# EAGLE design Own_RPi.Streamerboard.pro_v1.2_Final_AR (EAGLE 9.6.2)
COMPANY: ADAFRUIT INDUSTRIES; DRAWN: KTOWN; REV: A; YEAR: 2019
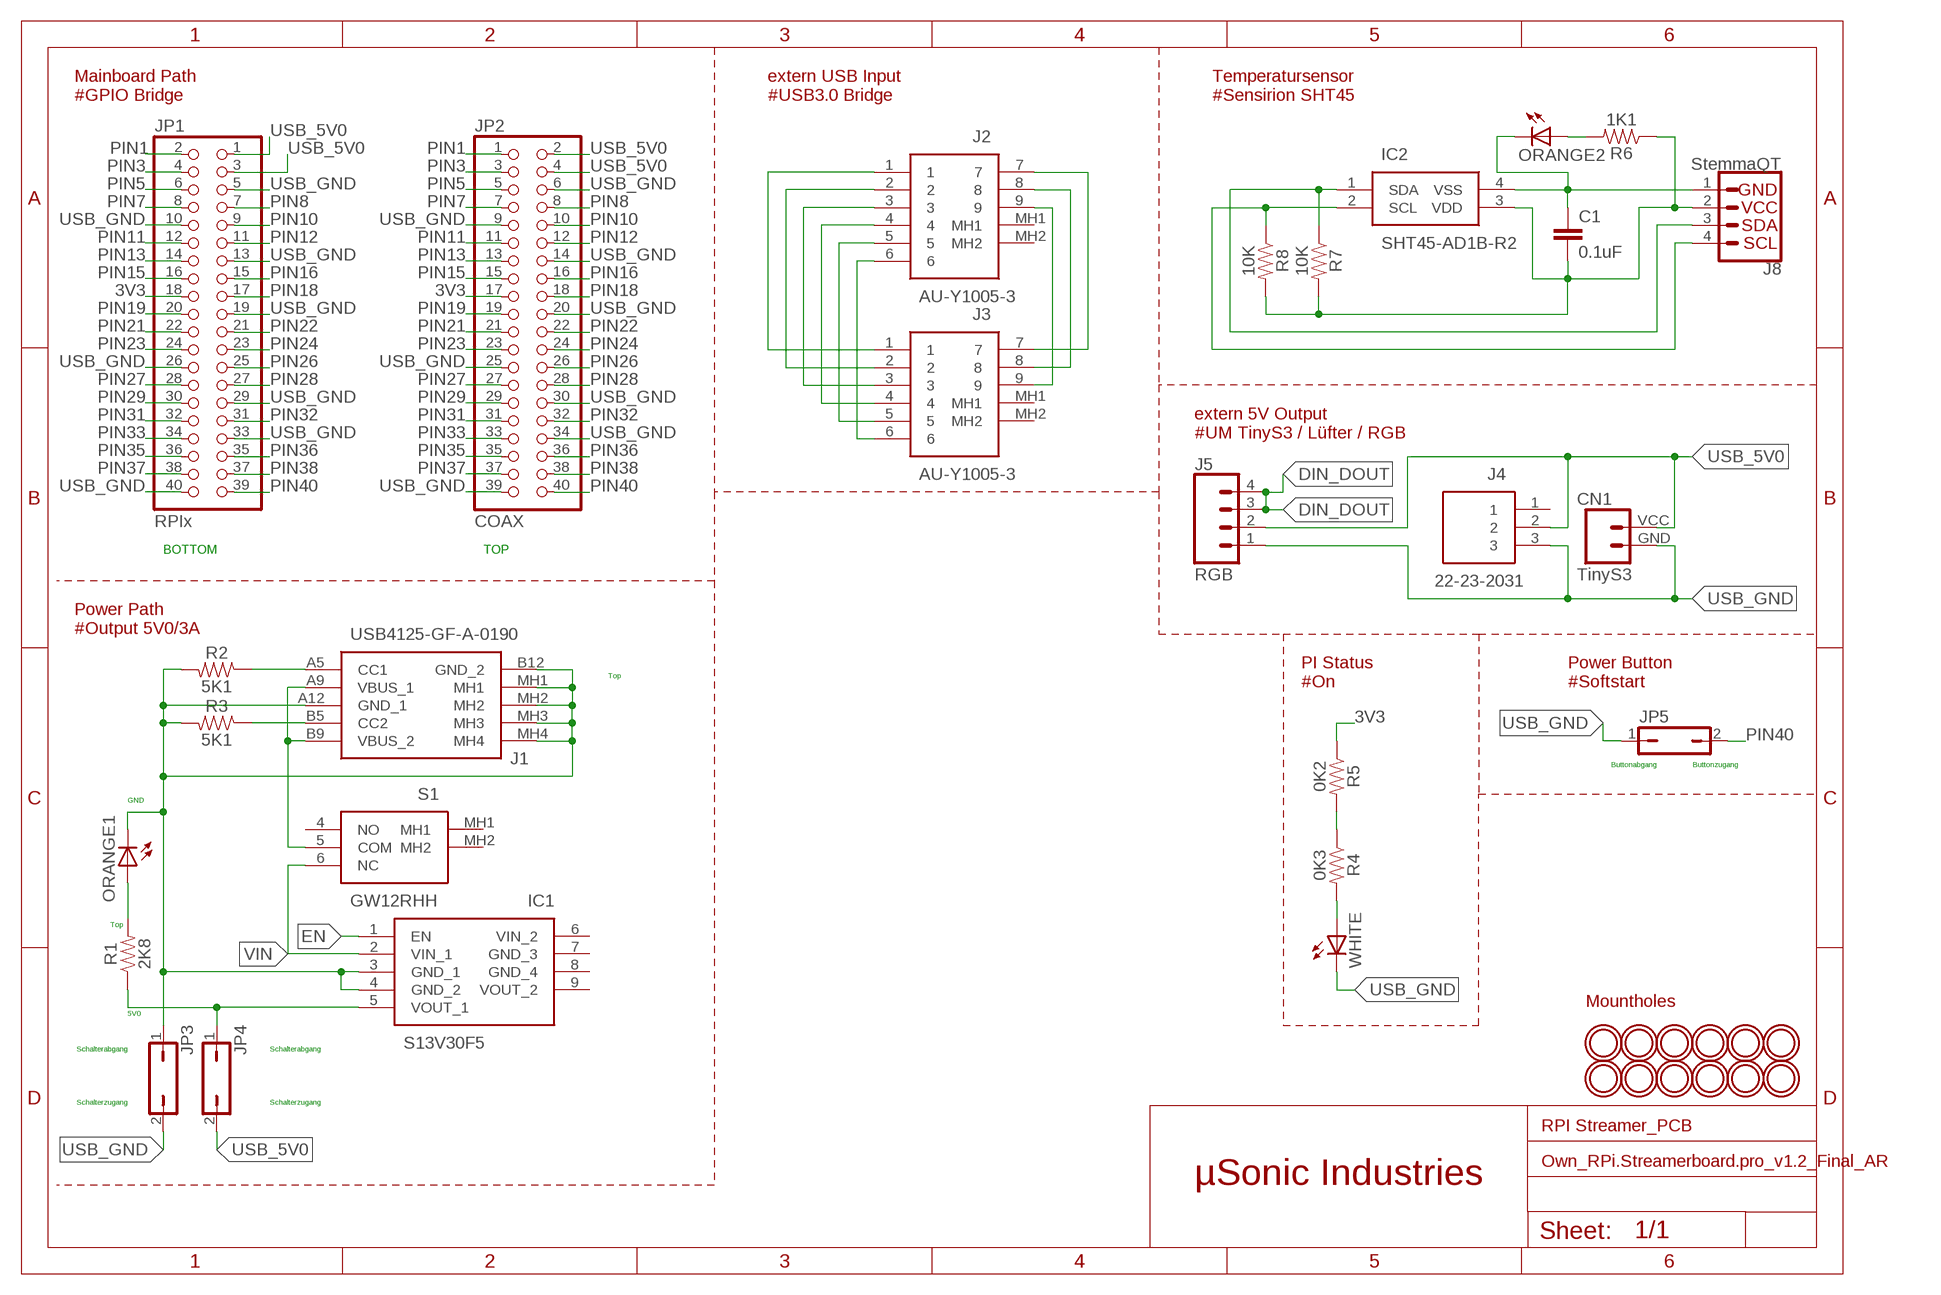
[diagram p0: schematic, sheet 1]

## Parts
C1  0.1uF  1.0UF-0805-25V-10%  [0805]
CN1  TinyS3  CONN_024UCON-15767  [JST-2-SMD-VERT]
IC1  S13V30F5  [S13V30F5]
IC2  SHT45-AD1B-R2  [SHT45AD1BR2]
J1  USB4125-GF-A-0190  [USB4125GFA0190]
J2  AU-Y1005-3  [AUY10053]
J3  AU-Y1005-3  [AUY10053]
J4  22-23-2031  [SHDR3W82P0X254_1X3_747X635X818]
J5  RGB  CONN_04PTH  [1X04]
J8  StemmaQT  QWIIC_CONNECTOROWN  [JST04_1MM_VERT]
JP1  RPIx  PINHD-2X20-BIG  [2X20-BIG]
JP2  COAX  PINHD-2X20-BIG  [2X20-BIG]
JP3  JP1Q  [JP1]
JP4  JP1Q  [JP1]
JP5  JP1Q  [JP1]
ORANGE1  LEDCHIPLED_0805  [CHIPLED_0805]
ORANGE2  LEDCHIPLED_0805  [CHIPLED_0805]
R1  2K8  RESISTOR0805  [0805]
R2  5K1  RESISTOR0805  [0805]
R3  5K1  RESISTOR0805  [0805]
R4  0K3  RESISTOR0805  [0805]
R5  0K2  RESISTOR0805  [0805]
R6  1K1  RESISTOR0805  [0805]
R7  10K  RESISTOR0805  [0805]
R8  10K  RESISTOR0805  [0805]
S1  GW12RHH  [GW12RHH]
U$3  MOUNTINGHOLE2.5  [MOUNTINGHOLE_2.5_PLATED]
U$5  MOUNTINGHOLE2.5  [MOUNTINGHOLE_2.5_PLATED]
U$8  MOUNTINGHOLE2.5  [MOUNTINGHOLE_2.5_PLATED]
U$9  MOUNTINGHOLE2.5  [MOUNTINGHOLE_2.5_PLATED]
U$10  MOUNTINGHOLE2.5  [MOUNTINGHOLE_2.5_PLATED]
U$11  MOUNTINGHOLE2.5  [MOUNTINGHOLE_2.5_PLATED]
U$12  MOUNTINGHOLE2.5  [MOUNTINGHOLE_2.5_PLATED]
U$13  MOUNTINGHOLE2.5  [MOUNTINGHOLE_2.5_PLATED]
U$14  MOUNTINGHOLE2.5  [MOUNTINGHOLE_2.5_PLATED]
U$15  MOUNTINGHOLE2.5  [MOUNTINGHOLE_2.5_PLATED]
U$16  MOUNTINGHOLE2.5  [MOUNTINGHOLE_2.5_PLATED]
U$17  MOUNTINGHOLE2.5  [MOUNTINGHOLE_2.5_PLATED]
WHITE  LEDCHIPLED_0805  [CHIPLED_0805]

## Nets
3V3: JP1.18 JP2.17 R5.1
DIN_DOUT: J5.3 J5.4
EN: IC1.1(EN)
GND: IC1.3(GND_1) IC1.4(GND_2) J1.A12(GND_1) J1.B12(GND_2) J1.MH1 J1.MH2 J1.MH3 J1.MH4 JP3.1 ORANGE1.C R2.2 R3.2
N$1: ORANGE1.A R1.2
N$2: R4.1 R5.2
N$3: J1.B5(CC2) R3.1
N$4: J1.A5(CC1) R2.1
N$5: J2.4 J3.4
N$6: ORANGE2.A R6.2
N$7: R4.2 WHITE.A
N$10: C1.2 IC2.3(VDD) J8.2 R6.1 R7.2 R8.2
N$13: C1.1 IC2.4(VSS) J8.1 ORANGE2.C
N$14: IC2.2(SCL) J8.4 R8.1
N$15: J2.6 J3.6
N$16: IC2.1(SDA) J8.3 R7.1
N$17: J2.5 J3.5
N$19: J2.3 J3.3
N$20: J2.2 J3.2
N$21: J2.1 J3.1
N$22: J2.9 J3.9
N$23: J2.8 J3.8
N$24: J2.7 J3.7
PIN1: JP1.2 JP2.1
PIN3: JP1.4 JP2.3
PIN5: JP1.6 JP2.5
PIN7: JP1.8 JP2.7
PIN8: JP1.7 JP2.8
PIN10: JP1.9 JP2.10
PIN11: JP1.12 JP2.11
PIN12: JP1.11 JP2.12
PIN13: JP1.14 JP2.13
PIN15: JP1.16 JP2.15
PIN16: JP1.15 JP2.16
PIN18: JP1.17 JP2.18
PIN19: JP1.20 JP2.19
PIN21: JP1.22 JP2.21
PIN22: JP1.21 JP2.22
PIN23: JP1.24 JP2.23
PIN24: JP1.23 JP2.24
PIN26: JP1.25 JP2.26
PIN27: JP1.28 JP2.27
PIN28: JP1.27 JP2.28
PIN29: JP1.30 JP2.29
PIN31: JP1.32 JP2.31
PIN32: JP1.31 JP2.32
PIN33: JP1.34 JP2.33
PIN35: JP1.36 JP2.35
PIN36: JP1.35 JP2.36
PIN37: JP1.38 JP2.37
PIN38: JP1.37 JP2.38
PIN40: JP1.39 JP2.40 JP5.2
USB_5V0: CN1.VCC J4.2 J5.2 JP1.1 JP1.3 JP2.2 JP2.4 JP4.2
USB_GND: CN1.GND J4.3 J5.1 JP1.5 JP1.10 JP1.13 JP1.19 JP1.26 JP1.29 JP1.33 JP1.40 JP2.6 JP2.9 JP2.14 JP2.20 JP2.25 JP2.30 JP2.34 JP2.39 JP3.2 JP5.1 WHITE.C
VBUS_VIN: J1.A9(VBUS_1) J1.B9(VBUS_2) S1.5(COM)
VIN: IC1.2(VIN_1) S1.6(NC)
VOUT: IC1.5(VOUT_1) JP4.1 R1.1
Unconnected: IC1.6(VIN_2) IC1.7(GND_3) IC1.8(GND_4) IC1.9(VOUT_2) J2.MH1 J2.MH2 J3.MH1 J3.MH2 J4.1 S1.4(NO) S1.MH1 S1.MH2

## Notes on the sheet
- Mainboard Path
  #GPIO Bridge
- extern USB Input
  #USB3.0 Bridge
- Temperatursensor
  #Sensirion SHT45
- extern 5V Output
  #UM TinyS3 / Lüfter / RGB
- BOTTOM | TOP
- RGB
- Power Path
  #Output 5V0/3A
- Top
- PI Status
  #On
- Power Button
  #Softstart
- Buttonabgang | Buttonzugang
- GND
- Top
- Mountholes
- 5V0
- Schalterabgang | Schalterabgang
- Schalterzugang | Schalterzugang
- RPI Streamer_PCB
- µSonic Industries

## Library data of the parts
C1 = SparkFun-Capacitors:1.0UF: 1µF ceramic capacitors A capacitor is a passive two-terminal electrical component used to store electrical energy temporarily in an electric field.; PROD_ID: CAP-08064; VALUE: 1.0uF
CN1 = SparkFun-Connectors2:CONN_02: Multi connection point. Often used as Generic Header-pin footprint for 0.1 inch spaced/style header connections On any of the 0.1 inch spaced packages, you can populate with these: Break Away Headers - Straight <https://www.sparkfun.com/products/116> (PRT-00116) Break Away Male Headers - Right Angle <https://www.sparkfun.com/products/553> (PRT-00553) Female Headers <https://www.sparkfun.com/products/115> (PRT-00115) Break Away Headers - Machine Pin <https://www.sparkfun.com/products/117> (PRT-00117) Break Away Female Headers - Swiss Machine Pin <https://www.sparkfun.com/products/743> (PRT-00743) For SCREWTERMINALS and SPRING TERMINALS visit here: Screw Terimnals on SparkFun.com <https://www.sparkfun.com/search/results?term=Screw+Terminals> (5mm/3.5mm/2.54mm spacing) This device is also useful as a general connection point to wire up your design to another part of your project. Our various solder wires solder well into these plated through hole pads. Hook-Up Wire - Assortment (Stranded, 22 AWG) <https://www.sparkfun.com/products/11375> (PRT-11375) Hook-Up Wire - Assortment (Solid Core, 22 AWG) <https://www.sparkfun.com/products/11367> (PRT-11367) View the entire wire category on our website here <https://www.sparkfun.com/categories/141> Special notes: Molex polarized connector foot print use with: PRT-08233 with associated crimp pins and housings. 2.54_SCREWTERM for use with PRT-10571. 3.5mm Screw Terminal footprints for PRT-08084 5mm Screw Terminal footprints for use with PRT-08432
IC1 = S13V30F5:S13V30F5: 5V Step-Up/Step-Down Voltage Regulator Source: Datasheet <https://www.pololu.com/file/0J1807/5v-step-up-step-down-voltage-regulator-s13v30f5-dimensions.pdf>; DESCRIPTION: 5V Step-Up/Step-Down Voltage Regulator; HEIGHT: 9.57mm; MANUFACTURER_NAME: Pololu; MANUFACTURER_PART_NUMBER: S13V30F5
IC2 = SHT45-AD1B-R2:SHT45-AD1B-R2: 4 4th Generation, High-Accuracy, Ultra-Low-Power, 16-bit Relative Humidity and Temperature Sensor Source: Datasheet <https://www.mouser.de/datasheet/2/682/Datasheet_SHT4x-2936319.pdf>; ARROW_PART_NUMBER: SHT45-AD1B-R2; ARROW_PRICE-STOCK: https://www.arrow.com/en/products/sht45-ad1b-r2/sensirion-ag?region=nac; DESCRIPTION: 4 4th Generation, High-Accuracy, Ultra-Low-Power, 16-bit Relative Humidity and Temperature Sensor; HEIGHT: 0.59mm; MANUFACTURER_NAME: Sensirion; MANUFACTURER_PART_NUMBER: SHT45-AD1B-R2; MOUSER_PART_NUMBER: 403-SHT45-AD1B-R2; MOUSER_PRICE-STOCK: https://www.mouser.co.uk/ProductDetail/Sensirion/SHT45-AD1B-R2?qs=Znm5pLBrcAImXcmTJwn%2FTg%3D%3D
J1 = USB4125-GF-A-0190:USB4125-GF-A-0190: USB Connectors USB C Rec GF RA 6P SMT TH Stakes 1.9mm Source: Datasheet <https://eu.mouser.com/datasheet/2/837/usb4125-2448699.pdf>; DESCRIPTION: USB Connectors USB C Rec GF RA 6P SMT TH Stakes 1.9mm; HEIGHT: 3.41mm; MANUFACTURER_NAME: GCT (GLOBAL CONNECTOR TECHNOLOGY); MANUFACTURER_PART_NUMBER: USB4125-GF-A-0190; MOUSER_PART_NUMBER: 640-USB4125-GF-A-190; MOUSER_PRICE-STOCK: https://www.mouser.co.uk/ProductDetail/GCT/USB4125-GF-A-0190?qs=QNEnbhJQKvbCz4hEJBS24w%3D%3D
J2 J3 = AU-Y1005-3:AU-Y1005-3: CONN USB 3.0 R/A FMAL TYPE-A PCB Source: Datasheet <https://datasheet.datasheetarchive.com/originals/distributors/DKDS-12/221023.pdf>; ARROW_PART_NUMBER: AU-Y1005-3; ARROW_PRICE-STOCK: https://www.arrow.com/en/products/au-y1005-3/assmann-wsw-components-inc?region=nac; DESCRIPTION: CONN USB 3.0 R/A FMAL TYPE-A PCB; HEIGHT: 7.2mm; MANUFACTURER_NAME: ASSMANN WSW components GmbH; MANUFACTURER_PART_NUMBER: AU-Y1005-3
J4 = 22-23-2031:22-23-2031: 2.54mm,header,KK,vert,Sn,frictn lock,3w Molex KK 254 Series, Series Number 6373, 2.54mm Pitch 3 Way 1 Row Straight PCB Header, Through Hole, Solder Termination Source: Datasheet <http://www.molex.com/webdocs/datasheets/pdf/en-us//0022232031_PCB_HEADERS.pdf>; DESCRIPTION: 2.54mm,header,KK,vert,Sn,frictn lock,3w Molex KK 254 Series, Series Number 6373, 2.54mm Pitch 3 Way 1 Row Straight PCB Header, Through Hole, Solder Termination; HEIGHT: 8.18mm; MANUFACTURER_NAME: Molex; MANUFACTURER_PART_NUMBER: 22-23-2031; MOUSER_PART_NUMBER: 538-22-23-2031; MOUSER_PRICE-STOCK: https://www.mouser.co.uk/ProductDetail/Molex/22-23-2031?qs=ILqg114nvd41XyIAFDpXfw%3D%3D
J5 = SparkFun-Connectors2:CONN_04: Multi connection point. Often used as Generic Header-pin footprint for 0.1 inch spaced/style header connections On any of the 0.1 inch spaced packages, you can populate with these: Break Away Headers - Straight <https://www.sparkfun.com/products/116> (PRT-00116) Break Away Male Headers - Right Angle <https://www.sparkfun.com/products/553> (PRT-00553) Female Headers <https://www.sparkfun.com/products/115> (PRT-00115) Break Away Headers - Machine Pin <https://www.sparkfun.com/products/117> (PRT-00117) Break Away Female Headers - Swiss Machine Pin <https://www.sparkfun.com/products/743> (PRT-00743) For SCREWTERMINALS and SPRING TERMINALS visit here: Screw Terimnals on SparkFun.com <https://www.sparkfun.com/search/results?term=Screw+Terminals> (5mm/3.5mm/2.54mm spacing) This device is also useful as a general connection point to wire up your design to another part of your project. Our various solder wires solder well into these plated through hole pads. Hook-Up Wire - Assortment (Stranded, 22 AWG) <https://www.sparkfun.com/products/11375> (PRT-11375) Hook-Up Wire - Assortment (Solid Core, 22 AWG) <https://www.sparkfun.com/products/11367> (PRT-11367) View the entire wire category on our website here <https://www.sparkfun.com/categories/141> Special notes: Molex polarized connector foot print use with SKU : PRT-08231 with associated crimp pins and housings. 1MM SMD Version SKU: PRT-10208; PROD_ID: CONN-09696
J8 = SparkFun-Connectors2:QWIIC_CONNECTOR: SparkFun I2C Standard Qwiic Connector An SMD 1mm pitch JST connector makes it easy and quick (get it? Qwiic?) to connect I2C devices to each other. The Qwiic system <http://www.sparkfun.com/qwiic> enables fast and solderless connection between popular platforms and various sensors and actuators. We carry 200mm <https://www.sparkfun.com/products/14204>, 100mm <https://www.sparkfun.com/products/14205>, 50mm <https://www.sparkfun.com/products/14206>, and breadboard friendly <https://www.sparkfun.com/products/14207> Qwiic cables. We also offer 10 pcs strips <https://www.sparkfun.com/products/14323> the SMD connectors.; PROD_ID: CONN-14483; VALUE: Vertical Qwiic Connector
JP1 JP2 = adafruit:PINHD-2X20: PIN HEADER
JP3-JP5 = jumper:JP1Q: JUMPER
ORANGE1 ORANGE2 WHITE = adafruit:LED: LED OSRAM: - CHIPLED LG R971, LG N971, LY N971, LG Q971, LY Q971, LO R971, LY R971 LH N974, LH R974 LS Q976, LO Q976, LY Q976 LO Q996 - Hyper CHIPLED LW Q18S LB Q993, LB Q99A, LB R99A - SideLED LS A670, LO A670, LY A670, LG A670, LP A670 LB A673, LV A673, LT A673, LW A673 LH A674 LY A675 LS A676, LA A676, LO A676, LY A676, LW A676 LS A679, LY A679, LG A679 - Hyper Micro SIDELED® LS Y876, LA Y876, LO Y876, LY Y876 LT Y87S - SmartLED LW L88C, LW L88S LB L89C, LB L89S, LG L890 LS L89K, LO L89K, LY L89K LS L896, LA L896, LO L896, LY L896 - TOPLED LS T670, LO T670, LY T670, LG T670, LP T670 LSG T670, LSP T670, LSY T670, LOP T670, LYG T670 LG T671, LOG T671, LSG T671 LB T673, LV T673, LT T673, LW T673 LH T674 LS T676, LA T676, LO T676, LY T676, LB T676, LH T676, LSB T676, LW T676 LB T67C, LV T67C, LT T67C, LS T67K, LO T67K, LY T67K, LW E67C LS E67B, LA E67B, LO E67B, LY E67B, LB E67C, LV E67C, LT E67C LW T67C LS T679, LY T679, LG T679 LS T770, LO T770, LY T770, LG T770, LP T770 LB T773, LV T773, LT T773, LW T773 LH T774 LS E675, LA E675, LY E675, LS T675 LS T776, LA T776, LO T776, LY T776, LB T776 LHGB T686 LT T68C, LB T68C - Hyper Mini TOPLED® LB M676 - Mini TOPLED Santana® LG M470 LS M47K, LO M47K, LY M47K Source: http://www.osram.convergy.de/
R1-R8 = SparkFun-Resistors:RESISTOR: Generic Resistor Package
S1 = GW12RHH:GW12RHH: NKK SWITCHES - GW12RHH - Rocker Switch, On-None-On, SPDT, Non Illuminated, Through Hole, Grey, GW Series Source: Datasheet <https://www.nkkswitches.com/pdf/GW.pdf>; ARROW_PART_NUMBER: GW12RHH; ARROW_PRICE-STOCK: https://www.arrow.com/en/products/gw12rhh/nkk-switches?region=nac; DESCRIPTION: NKK SWITCHES - GW12RHH - Rocker Switch, On-None-On, SPDT, Non Illuminated, Through Hole, Grey, GW Series; HEIGHT: 5.4mm; MANUFACTURER_NAME: NKK Switches; MANUFACTURER_PART_NUMBER: GW12RHH; MOUSER_PART_NUMBER: 633-GW12RHH; MOUSER_PRICE-STOCK: https://www.mouser.co.uk/ProductDetail/NKK-Switches/GW12RHH?qs=4EnmSMTL3HPCG3meE6aDvQ%3D%3D
U$3 U$5 U$8-U$17 = microbuilder:MOUNTINGHOLE: Mounting Hole For #2 screws (0.086"/2.18mm width, 0.094"/2.4mm hole) use 2.5mm; BOM: EXCLUDE

## Net classes
0 default: width 0.25 mm

## Board
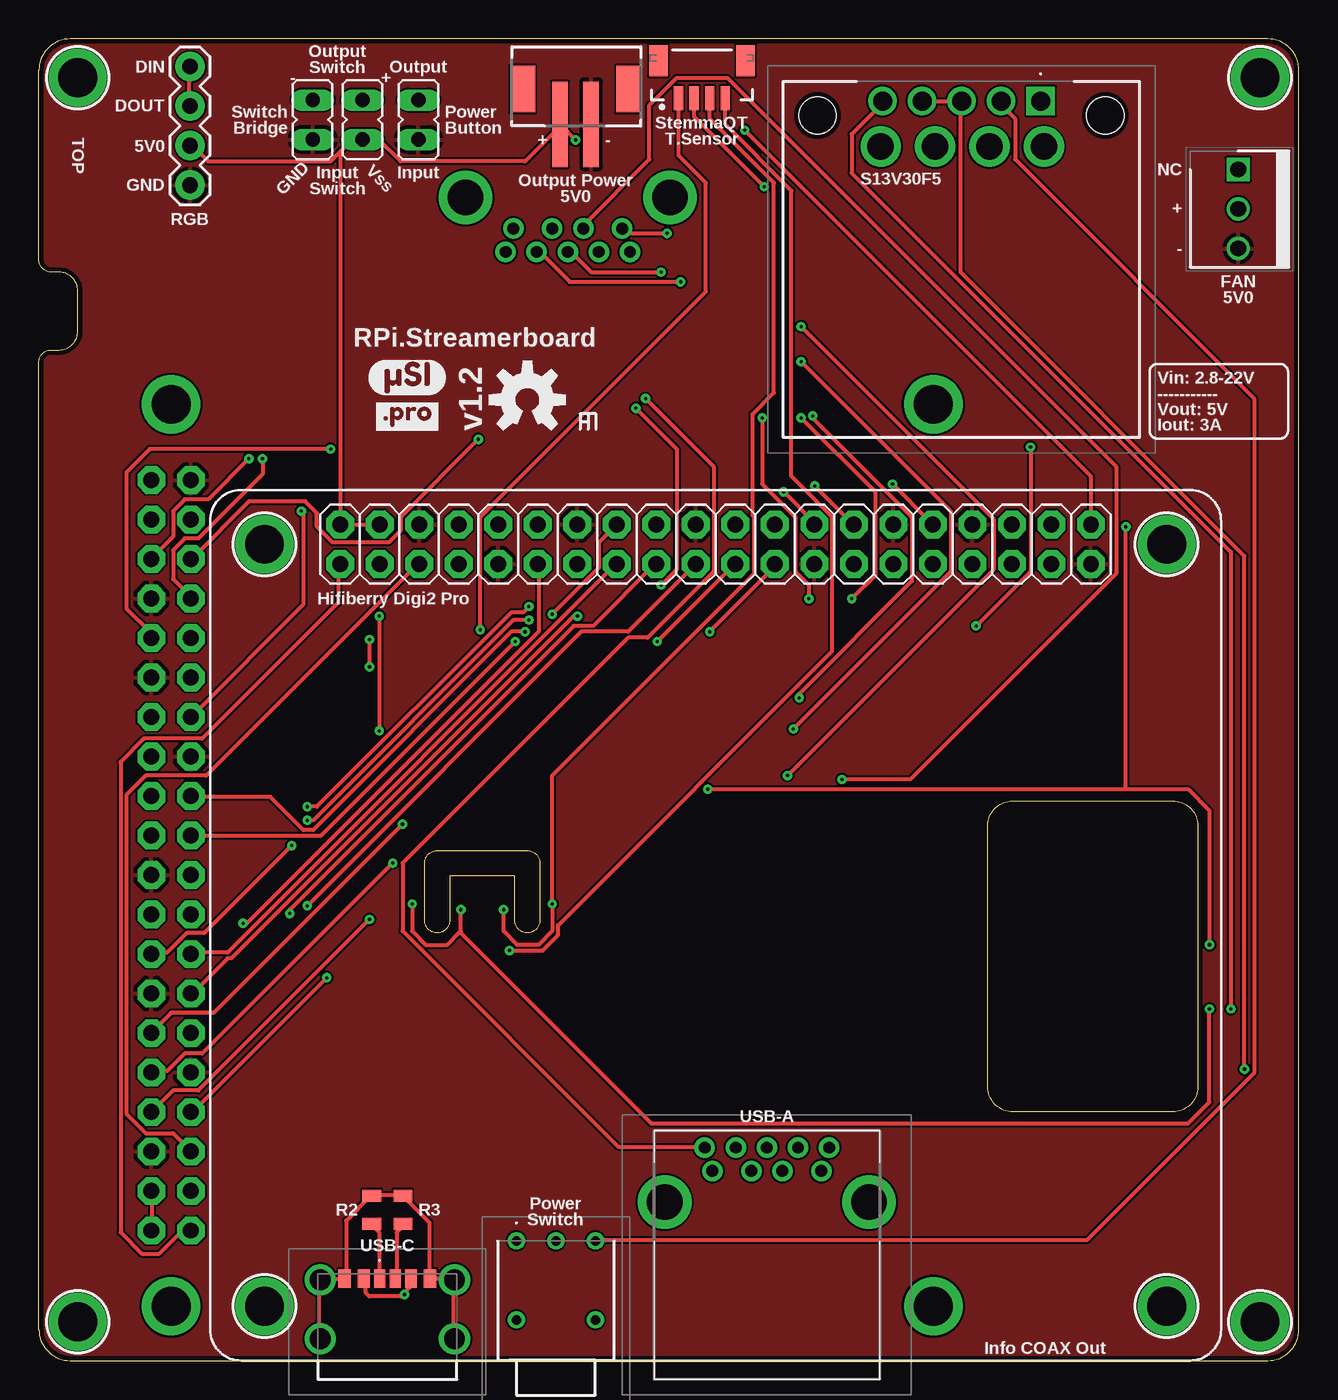
[diagram p1: board, top side]
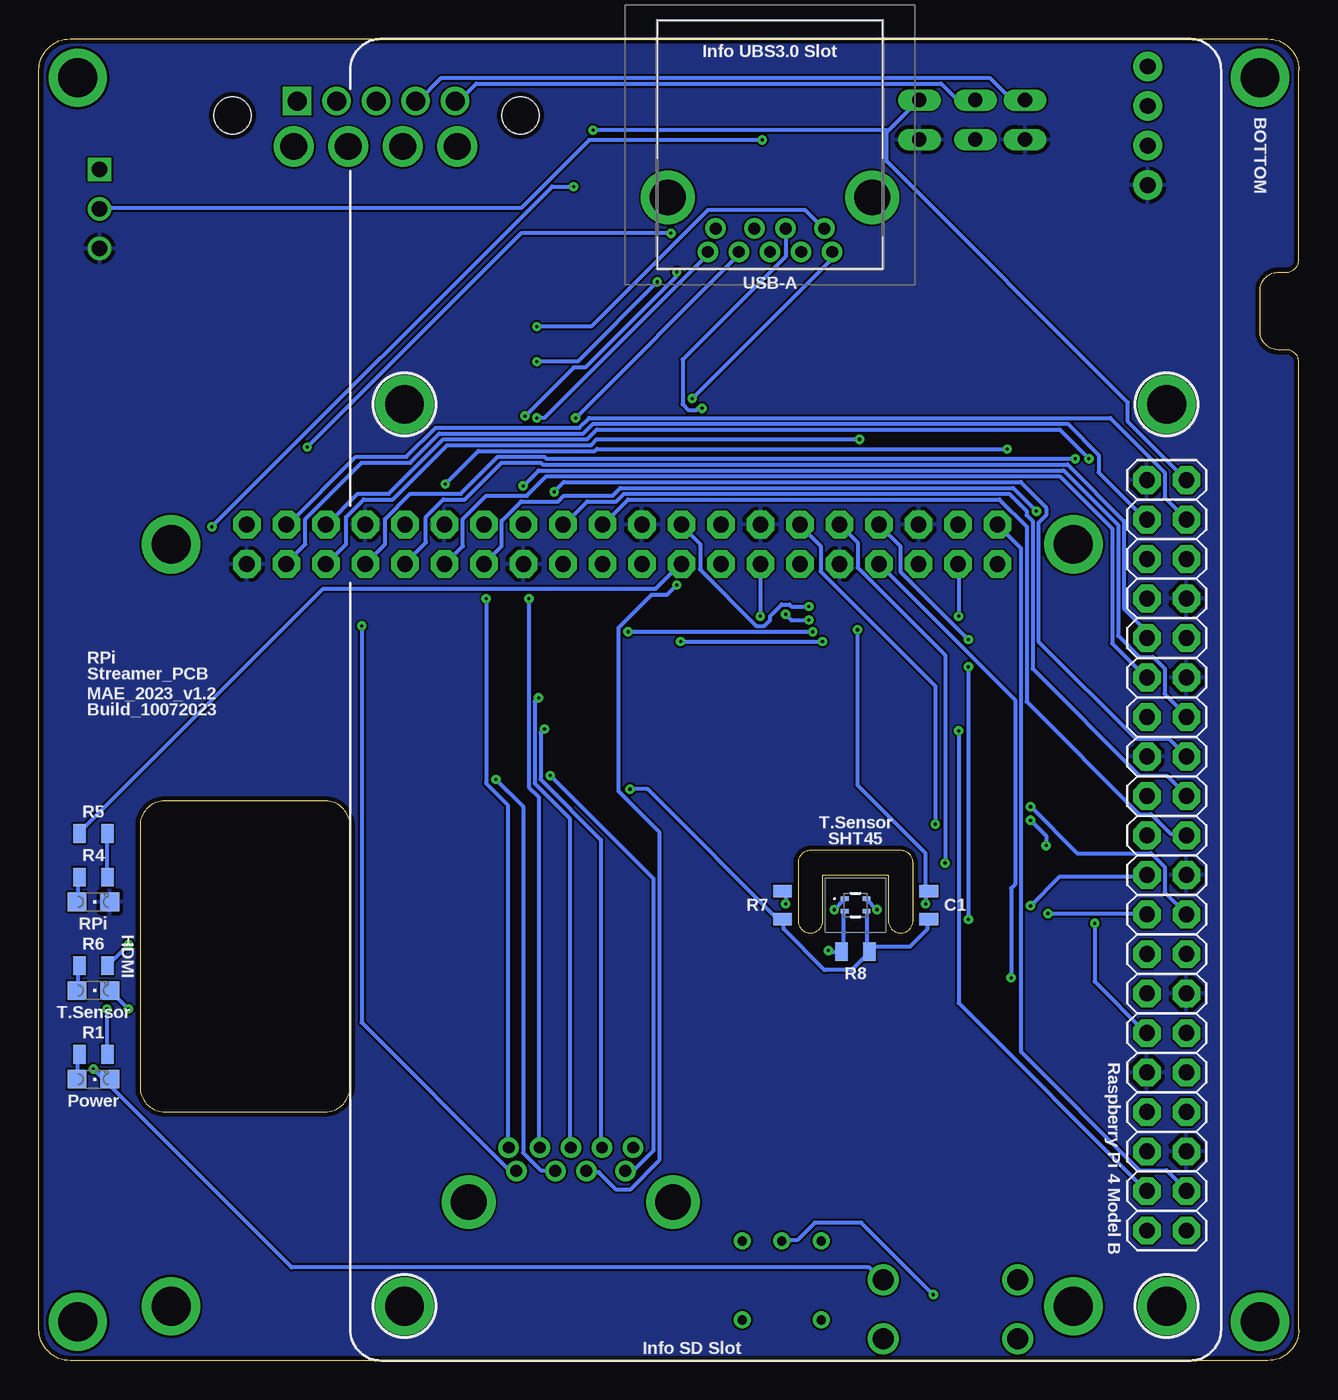
[diagram p2: board, bottom side, seen from below]

Size 81 x 85 mm. Coordinates in mm from the lower left corner, seen from the top.
Outline: 0,70.8 0,83 arc-90 2,85 79,85 arc-90 81,83 81,2 arc-90 79,0 2,0 arc-90 0,2 0,64.2 arc-90 0.8,65 1.3,65 arc90 2.5,66.2 2.5,68.8 arc90 1.3,70 0.8,70 arc-90 0,70.8
Outline: 72.9,16 62.6,16 arc-90 61,17.6 61,34.4 arc-90 62.6,36 72.9,36 arc-90 74.5,34.4 74.5,17.6 arc-90 72.9,16
Outline: 26.4,31.2 26.4,28.3 arc-90 25.6,27.5 arc-90 24.8,28.3 24.8,32 arc-90 25.6,32.8 31.4,32.8 arc-90 32.2,32 32.2,28.3 arc-90 31.4,27.5 arc-90 30.6,28.3 30.6,31.2 26.4,31.2
Copper layers (1*16): Top 0.035mm / dielectric 1.5mm / Bottom 0.035mm
Design rules "aisler_2_layer_complex": minimum track width 0.125mm, minimum drill 0.2mm, track to track 0.125mm, track to pad 0.125mm, pad to pad 0.125mm, via to via 0.125mm, smd to smd 0.125mm, copper to edge 0.3mm, drill to drill 0.25mm, minimum pad ring 0.2mm, minimum via ring 0.2mm, stop-mask expansion 0mil, vias tented up to drill 0mil, thermal gap 10mil

### Footprints (pad centres in the part's own frame; a part is rotated, then mirrored left to right if it is on the bottom)
0805 = smd 0.8 x 1.2: 1 -0.9,0; 2 0.9,0
JST-2-SMD-VERT = smd 1 x 5.5: GND 1,-2; VCC -1,-2 | smd 1.6 x 3: P$1 -3.4,0.27; P$2 3.4,0.27
S13V30F5 = drill 1.22 pad 1.83 square: 1 0,0 | drill 1.22 pad 1.83: 2 2.54,0; 3 5.08,0; 4 7.62,0; 5 10.16,0 | drill 1.72 pad 2.58: 6 -0.21,2.92; 7 3.29,2.92; 8 6.79,2.92; 9 10.29,2.92 | hole 2.38: -4.15,0.93; 14.35,0.93
SHT45AD1BR2 = smd 0.5 x 0.3: 1 -0.7,0.4; 2 -0.7,-0.4; 3 0.7,-0.4; 4 0.7,0.4
USB4125GFA0190 = smd 0.7 x 1.2: A5 -0.5,3.08; B5 0.5,3.08 | smd 0.76 x 1.2: A9 1.52,3.08; B9 -1.52,3.08 | smd 0.8 x 1.2: A12 2.75,3.08; B12 -2.75,3.08 | drill 1.34 pad 2.01: MH1 -4.32,3; MH2 -4.32,-0.8; MH3 4.32,-0.8; MH4 4.32,3
AUY10053 = drill 0.77 pad 1.32: 1 0,0; 2 2,0; 3 4,0; 4 6,0; 5 8,0; 6 0.5,-1.5; 7 3,-1.5; 8 5,-1.5; 9 7.5,-1.5 | drill 2.3 pad 3.45: MH1 -2.57,-3.5; MH2 10.57,-3.5
SHDR3W82P0X254_1X3_747X635X818 = drill 1 pad 1.5 square: 1 0,0 | drill 1 pad 1.5: 2 2.54,0; 3 5.08,0
1X04 = drill 1.016 pad 1.88: 1 0,0; 2 2.54,0; 3 5.08,0; 4 7.62,0
JST04_1MM_VERT = smd 0.6 x 1.55: 1 -1.478,0.775; 2 -0.478,0.775; 3 0.522,0.775; 4 1.522,0.775 | smd 1.2 x 2: NC1 -2.778,3.2; NC2 2.822,3.2
2X20-BIG = drill 1.016 pad 1.778 octagon: 1 -24.13,-1.27; 2 -24.13,1.27; 3 -21.59,-1.27; 4 -21.59,1.27; 5 -19.05,-1.27; 6 -19.05,1.27; 7 -16.51,-1.27; 8 -16.51,1.27; 9 -13.97,-1.27; 10 -13.97,1.27; 11 -11.43,-1.27; 12 -11.43,1.27; 13 -8.89,-1.27; 14 -8.89,1.27; 15 -6.35,-1.27; 16 -6.35,1.27; 17 -3.81,-1.27; 18 -3.81,1.27; 19 -1.27,-1.27; 20 -1.27,1.27; 21 1.27,-1.27; 22 1.27,1.27; 23 3.81,-1.27; 24 3.81,1.27; 25 6.35,-1.27; 26 6.35,1.27; 27 8.89,-1.27; 28 8.89,1.27; 29 11.43,-1.27; 30 11.43,1.27; 31 13.97,-1.27; 32 13.97,1.27; 33 16.51,-1.27; 34 16.51,1.27; 35 19.05,-1.27; 36 19.05,1.27; 37 21.59,-1.27; 38 21.59,1.27; 39 24.13,-1.27; 40 24.13,1.27
JP1 = drill 0.914 long: 1 0,-1.27; 2 0,1.27
CHIPLED_0805 = smd 1.2 x 1.2: A 0,-1.05; C 0,1.05
GW12RHH = drill 0.6 pad 1.1: 4 0,0; 5 2.54,0; 6 5.08,0; MH1 0,-5.08; MH2 5.08,-5.08
MOUNTINGHOLE_2.5_PLATED = drill 2.5 pad 3.2: P$1 0,0

### Placement (x,y rotation side)
C1  23.8,29.3 270 bottom
CN1  34.5,81.5 0 top
IC1  64.4,81 180 top
IC2  28.5,29.3 0 bottom
J1  22.4,2.2 0 top
J2  42.8,13.7 0 top
J3  30,71.3 180 bottom
J4  77.1,76.6 270 top
J5  9.72,75.6 90 top
J8  42.6,80.4 0 top
JP1  8.5,32.5 90 bottom
JP2  43.5,52.5 0 top
JP3  17.6,79.8 180 top
JP4  20.8,79.8 180 top
JP5  24.4,79.8 0 top
ORANGE1  77.5,18.1 270 bottom
ORANGE2  77.5,23.8 270 bottom
R1  77.5,19.7 180 bottom
R2  21.4,9.7 90 top
R3  23.4,9.7 90 top
R4  77.5,31.1 180 bottom
R5  77.5,33.9 0 bottom
R6  77.5,25.4 180 bottom
R7  33.2,29.3 270 bottom
R8  28.5,26.3 0 bottom
S1  30.7,7.7 0 top
U$1  [.PRO_LARGE]  21.7,59.8 0 top
U$2  [OSHW-LOGO-M]  31.4,61.8 0 top
U$3  14.5,52.5 0 top
U$5  72.5,3.5 0 top
U$8  8.5,61.5 0 bottom
U$9  8.5,3.5 0 bottom
U$10  14.5,3.5 0 top
U$11  57.5,3.5 0 bottom
U$12  72.5,52.5 0 top
U$13  78.5,2.5 0 top
U$14  2.5,82.5 0 top
U$15  78.5,82.5 0 top
U$16  2.5,2.5 0 top
U$17  57.5,61.5 0 bottom
U$18  [µSI_LARGE]  21.2,62.1 0 top
WHITE  77.5,29.5 270 bottom

### Tracks (layer width: path | path; a pad name or v marks a point on that pad's centre or on a via)
3V3  (via drill 0.2)
  Top 0.25: v16.12,28.75 16.12,29 34.38,47.25 35.62,47.25 39.62,51.25 JP2.17
  Bottom 0.25: R5.1 78.38,34 62.75,49.62 41.38,49.62 39.75,51.25 JP2.17 | v16.12,28.75 9.88,28.75 JP1.18
DIN_DOUT
  Top 0.25: J5.3 9.62,80.75 9.62,83.12 J5.4
GND  (via drill 0.2)
  Top 0.25: IC1.4 59.25,81 | J1.MH2 18,1.5 18,5.12 J1.MH1 18.12,5.25 19.62,5.25 J1.B12 19.75,5.38 19.75,9 21.38,10.62 R2.2 21.5,10.62 23.38,10.62 R3.2 25.12,8.88 25.12,5.38 J1.A12 25.25,5.25 26.62,5.25 J1.MH4 26.62,5.12 26.62,1.5 J1.MH3 | 59.25,81 59.25,70 77.5,51.75 v77.5,18.75 | 59.25,81 IC1.3
  Bottom 0.25: IC1.4 56.62,81 55.12,82.5 19.88,82.5 18.5,81.12 17.62,81.12 JP3.1 | 76.38,17.62 76.38,18 ORANGE1.C 76.38,17.62 | 76.38,17.62 64.75,6 27.62,6 26.75,5.12 J1.MH4 | 76.38,17.62 v77.5,18.75
N$1
  Bottom 0.25: R1.2 78.5,19.62 78.5,18.12 ORANGE1.A
N$2
  Bottom 0.25: R4.1 76.62,31.12 76.62,33.88 R5.2
N$3
  Top 0.25: J1.B5 23,5.38 23,8.25 23.5,8.75 R3.1
N$4
  Top 0.25: J1.A5 21.88,5.38 21.88,8.25 21.38,8.75 R2.1
N$5  (via drill 0.2)
  Top 0.25: v49.5,49 49.5,49.88 48.62,50.75 48.62,54.25 46.5,56.38 v46.5,60.62
  Bottom 0.25: v49.5,49 49.5,36.88 48.88,36.25 48.88,13.75 J2.4 | v46.5,60.62 36,71.12 J3.4
N$6
  Bottom 0.25: ORANGE2.A 78.5,23.88 78.5,25.38 R6.2
N$7
  Bottom 0.25: WHITE.A 78.5,29.5 78.5,31 R4.2
N$10  (via drill 0.2)
  Top 0.25: v75.25,26.75 75.25,35.38 73.88,36.75 69.88,36.75 | v43,36.75 69.88,36.75 | v46.62,75.5 42.12,80 42.12,81.12 J8.2 | 69.88,36.75 v69.88,53.62
  Bottom 0.25: 27.75,26.62 27.75,26.5 27.62,26.38 R8.2 | 27.75,26.62 27.75,28.88 IC2.3 | 27.75,26.62 25,26.62 23.88,27.75 23.88,28.38 C1.2 | 27.75,26.62 R8.2 | 33.12,28 33.12,27.75 30.5,25.12 28.75,25.12 27.62,26.25 R8.2 | 33.12,28 33.12,28.38 R7.2 | v75.25,26.75 R6.1 | v43,36.75 41.88,36.75 33.12,28 | v46.62,75.5 48,75.5 v69.88,53.62
N$13  (via drill 0.2)
  Top 0.25: v27.12,29 27.12,27.62 27.06,27.56 | 27.06,27.56 26.25,26.75 24.88,26.75 24,27.62 v24,29.38 | v75.25,22.62 75.25,16.62 73.88,15.25 39.38,15.25 27.06,27.56 | v28.38,47 28.38,54.25 42.88,68.75 42.88,75.75 41.12,77.5 41.12,81.12 J8.1
  Bottom 0.25: v27.12,29 27.75,29.62 IC2.4 | v24,29.38 24,30 C1.1 24,30.12 24,32.62 28.38,37 v28.38,47 | v75.25,22.62 76.38,23.75 ORANGE2.C
N$14  (via drill 0.2)
  Top 0.25: v30.25,26.38 32.38,26.38 33.38,27.38 33.38,28 51,45.62 51,54.25 48.38,56.88 48.38,75.25 44.12,79.5 44.12,81.12 J8.4
  Bottom 0.25: IC2.2 29.25,28.88 29.25,26.5 29.38,26.38 R8.1 29.5,26.25 30.12,26.25 v30.25,26.38
N$15  (via drill 0.2)
  Top 0.25: v48.12,37.62 61.38,50.88 61.38,54.12 v49,66.5
  Bottom 0.25: v48.12,37.62 41.5,31 41.5,13.5 42.75,12.25 43.25,12.25 J2.6 | v49,66.5 45.5,66.5 38,74 31.75,74 30.5,72.75 J3.6
N$16  (via drill 0.2)
  Top 0.25: v29.88,29 29.88,27.62 30.75,26.75 32.12,26.75 33,27.62 v33,29.38 33,37.62 46,50.62 46,54.25 45.88,54.38 45.88,60.88 47.25,62.25 47.25,75.75 43.12,79.88 43.12,81.12 J8.3
  Bottom 0.25: v29.88,29 29.25,29.62 IC2.1 | v33,29.38 33,30 R7.1
N$17  (via drill 0.2)
  Top 0.25: v52.25,49 53.75,50.5 53.75,55.88 v49,60.62
  Bottom 0.25: v52.25,49 52.25,37.12 50.88,35.75 50.88,13.75 J2.5 | v49,60.62 48.5,60.62 38,71.12 J3.5
N$19  (via drill 0.2)
  Top 0.25: v48.88,42.62 48.88,42.88 56.12,50.12 56.12,54.25 49.75,60.62 v49.75,60.75 | v40,70 35.5,70 34.25,71.25 34,71.25 J3.3
  Bottom 0.25: v48.88,42.62 49.12,42.38 49.12,37.12 46.88,34.88 46.88,13.75 J2.3 | v49.75,60.75 46.62,63.88 45.88,63.88 40,69.75 v40,70
N$20  (via drill 0.2)
  Top 0.25: v48.5,40.62 58.62,50.75 58.62,54.62 v49,64.25 | v41.25,69.38 34.12,69.38 32.25,71.25 32,71.25 J3.2
  Bottom 0.25: v48.5,40.62 48.75,40.38 48.75,37.38 44.88,33.5 44.88,13.75 J2.2 | v49,64.25 46.38,64.25 v41.25,69.38
N$21  (via drill 0.2)
  Top 0.25: v39,61.88 43.38,57.5 43.38,50.75 39.12,46.5 37.88,46.5 23.38,32 23.38,27.62 37.25,13.75 42.75,13.75 J2.1
  Bottom 0.25: v39,61.88 30,70.88 J3.1
N$22  (via drill 0.2)
  Top 0.25: v60.25,47.25 63.75,50.75 v63.75,58.75 | v40.38,72.5 37.75,72.5 37.5,72.75 J3.9
  Bottom 0.25: v60.25,47.25 60.25,21.75 50.75,12.25 50.38,12.25 J2.9 | v63.75,58.75 50,72.5 v40.38,72.5
N$23  (via drill 0.2)
  Top 0.25: v51.62,37.38 56,37.38 69.25,50.62 69.25,57.5 44.25,82.5 41,82.5 39.25,80.75 39.25,77.25 35,73 J3.8
  Bottom 0.25: v51.62,37.38 49.88,35.62 49.88,13.38 48.75,12.25 47.88,12.25 J2.8
N$24  (via drill 0.2)
  Top 0.25: v40,49.88 41,50.88 41,58.62 v38.38,61.25
  Bottom 0.25: v40,49.88 40.62,49.25 41.62,49.25 43.75,47.12 43.75,36.62 41.12,34 41.12,12.88 43,11 43.88,11 45,12.12 45.75,12.12 J2.7 | v38.38,61.25 38.62,61.25 38.75,61.12 39.25,61.12 39.62,61.5 39.62,64.38 33,71 J3.7
PIN1
  Top 0.25: JP1.2 9.75,8.25 9.12,8.25 7.75,6.88 6.62,6.88 5.25,8.25 5.25,38.5 6.75,40 10.5,40 19.25,48.75 19.25,51.12 JP2.1
PIN3  (via drill 0.2)
  Top 0.25: v21.88,47.88 v21.88,40.5
  Bottom 0.25: v21.88,40.5 21.88,23 9.88,11 JP1.4 | v21.88,47.88 21.88,51.12 JP2.3
PIN5
  Top 0.25: JP1.6 9.75,13.5 8.62,14.62 6.88,14.62 5.62,15.88 5.62,36.38 6.88,37.62 10.75,37.62 24.38,51.25 JP2.5
PIN7  (via drill 0.2)
  Top 0.25: v18.5,24.62 9.88,16 JP1.8
  Bottom 0.25: v18.5,24.62 18.5,30.38 18.25,30.62 18.25,42.5 26.88,51.12 JP2.7
PIN8  (via drill 0.2)
  Top 0.25: v21.25,28.38 10.25,17.38 8.62,17.38 7.25,16 JP1.7 | v21.25,46.38 v21.25,44.62
  Bottom 0.25: v21.25,44.62 v21.25,28.38 | v21.25,46.38 25.62,50.75 25.62,52.38 27,53.75 JP2.8
PIN10  (via drill 0.2)
  Top 0.25: v22.75,32 10.5,19.75 9.38,19.75 8.25,18.62 7.25,18.62 JP1.9
  Bottom 0.25: v22.75,32 22.75,45.38 28.38,51 28.38,52.62 29.5,53.75 JP2.10
PIN11  (via drill 0.2)
  Top 0.25: v13.12,28.12 13.38,28.12 32.12,46.88 32.12,51.12 JP2.11
  Bottom 0.25: v13.12,28.12 13.12,24.38 9.88,21.12 JP1.12
PIN12  (via drill 0.2)
  Top 0.25: v23.38,34.5 11.25,22.38 8.5,22.38 7.25,21.12 JP1.11
  Bottom 0.25: v23.38,34.5 23.38,43.38 30.75,50.75 30.75,52.38 32.12,53.75 JP2.12
PIN13  (via drill 0.2)
  Top 0.25: v34.62,47.88 34.38,47.88 12.38,25.88 12.12,25.88 9.88,23.62 JP1.14
  Bottom 0.25: v34.62,47.88 34.62,51.12 JP2.13
PIN15
  Top 0.25: JP1.16 9.88,26.25 12.12,26.25 37.12,51.25 JP2.15
PIN16  (via drill 0.2)
  Top 0.25: v16.25,33.12 10.62,27.5 9.5,27.5 8.25,26.25 7.25,26.25 JP1.15 | v17.25,34.75 17.62,34.75 30.5,47.62 v31.5,47.62 | v33,48 36,51 36,52.62 37.12,53.75 JP2.16
  Bottom 0.25: v16.25,33.12 16.25,33.75 v17.25,34.75 | v31.5,47.62 32.62,47.62 v33,48
PIN18  (via drill 0.2)
  Top 0.25: v17.25,35.62 17.88,35.62 30.38,48.12 31.12,48.12 v31.5,48.5
  Bottom 0.25: v17.25,35.62 14.25,32.62 9.5,32.62 8.62,31.75 8.62,30.12 7.25,28.75 JP1.17 | v31.5,48.5 32.62,48.5 32.75,48.62 33.25,48.62 34,47.88 34,47.62 34.38,47.25 34.88,47.25 38.5,50.88 38.5,52.5 39.75,53.75 JP2.18
PIN19  (via drill 0.2)
  Top 0.25: v17.25,29.25 34.88,46.88 37.88,46.88 JP2.19
  Bottom 0.25: v17.25,29.25 15.38,31.12 9.88,31.12 JP1.20
PIN21  (via drill 0.2)
  Top 0.25: v30.62,46.25 18.12,33.75 9.88,33.75 JP1.22 | v39.75,46.25 44.75,51.25 JP2.21
  Bottom 0.25: v39.75,46.25 v30.62,46.25
PIN22
  Bottom 0.25: JP1.21 7.25,33.88 8.25,33.88 9.5,35.12 10.25,35.12 17.5,42.38 17.5,53.62 19.25,55.38 43.12,55.38 44.75,53.75 JP2.22
PIN23  (via drill 0.2)
  Top 0.25: v31.25,46.88 30.38,46.88 17.62,34.12 17,34.12 14.88,36.25 9.88,36.25 JP1.24 | v43.12,46.88 47.38,51.12 JP2.23
  Bottom 0.25: v43.12,46.88 v31.25,46.88
PIN24
  Bottom 0.25: JP1.23 7.25,36.38 8.5,37.62 10.25,37.62 17.12,44.5 17.12,54 17.5,54.38 17.5,54.62 18.62,55.75 43.38,55.75 43.88,55.25 45.75,55.25 47.25,53.75 JP2.24
PIN26  (via drill 0.2)
  Top 0.25: v47.88,55.88 49.88,53.88 JP2.26
  Bottom 0.25: v47.88,55.88 47.25,56.5 17.88,56.5 16.25,54.88 16.25,54.38 16.75,53.88 16.75,46.25 10.5,40 8.38,40 7.25,38.88 JP1.25
PIN27  (via drill 0.2)
  Top 0.25: v16.88,54.62 17,54.5 17,48.62 9.88,41.5 JP1.28
  Bottom 0.25: v16.88,54.62 18.38,56.12 43.62,56.12 44.12,55.62 47.25,55.62 47.62,55.25 50,55.25 51.25,54 51.25,52.38 52.38,51.25 JP2.27
PIN28  (via drill 0.2)
  Top 0.25: v49.88,56.25 52.38,53.75 JP2.28
  Bottom 0.25: v49.88,56.25 48.88,57.25 15.12,57.25 11.62,53.75 11.62,46.62 10.25,45.25 9.38,45.25 8.62,44.5 8.62,42.88 7.25,41.5 JP1.27
PIN29
  Bottom 0.25: JP1.30 9.88,44 12,46.12 12,53.5 15.38,56.88 48.38,56.88 49.62,55.62 52.25,55.62 53.75,54.12 53.75,52.38 54.88,51.25 JP2.29
PIN31
  Bottom 0.25: JP1.32 9.88,46.5 9.88,47 11.25,48.38 11.25,54 14.88,57.62 48.62,57.62 48.75,57.75 51.25,57.75 53.62,55.38 55,55.38 56.12,54.25 56.12,52.62 57.5,51.25 JP2.31
PIN32  (via drill 0.2)
  Top 0.25: v18.75,58.62 7.12,58.62 5.62,57.12 5.62,48.38 7.12,46.88 7.12,46.5 JP1.31 | v54.88,56.38 57.38,53.88 JP2.32
  Bottom 0.25: v18.75,58.62 45.12,58.62 45.25,58.5 52.75,58.5 v54.88,56.38
PIN33  (via drill 0.2)
  Top 0.25: v14.38,58 14.38,57 10.25,52.88 9.38,52.88 8.62,52.12 8.62,50.25 9.75,49.12 JP1.34
  Bottom 0.25: v14.38,58 48.38,58 48.5,58.12 51.5,58.12 53.88,55.75 57.12,55.75 58.75,54.12 58.75,52.5 60,51.25 JP2.33
PIN35  (via drill 0.2)
  Top 0.25: v28.25,59.25 23.25,54.25 23.25,53.38 22.5,52.62 18.88,52.62 17.88,53.62 17.88,54.5 17.12,55.25 13.5,55.25 9.88,51.62 JP1.36
  Bottom 0.25: v28.25,59.25 45.12,59.25 45.5,58.88 54.75,58.88 58.25,55.38 60.12,55.38 61.25,54.25 61.25,52.5 62.5,51.25 JP2.35
PIN36  (via drill 0.2)
  Top 0.25: v13.5,58 10.88,55.38 9.38,55.38 8.62,54.62 8.62,53 7.25,51.62 JP1.35
  Bottom 0.25: v13.5,58 15.38,59.88 45.12,59.88 45.75,59.25 55,59.25 58.5,55.75 60.5,55.75 62.5,53.75 JP2.36
PIN37
  Bottom 0.25: JP1.38 9.88,54.12 12.88,57.12 12.88,58.25 14.88,60.25 45.38,60.25 46,59.62 55.25,59.62 57.12,57.75 60.25,57.75 63.88,54.12 63.88,52.5 65.12,51.25 JP2.37
PIN38
  Bottom 0.25: JP1.37 7.25,54.12 8.62,55.5 8.62,57.12 12.12,60.62 45.62,60.62 46.25,60 55.5,60 57.38,58.12 60.62,58.12 65,53.75 JP2.38
PIN40  (via drill 0.2)
  Top 0.25: v45.38,79.12 67.62,56.88 67.62,53.88 JP2.40
  Bottom 0.25: 26.44,79.06 26.5,79 26.5,77.12 11,61.62 11,60.38 7.25,56.62 JP1.39 | 26.44,79.06 24.5,81 JP5.2 | v45.38,79.12 26.5,79.12 26.44,79.06
USB_5V0  (via drill 0.2)
  Top 0.25: JP1.1 7.25,8.38 7.25,10.88 JP1.3 | JP2.4 21.88,53.75 19.38,53.75 JP2.2 19.38,53.88 19.38,77.62 19.31,77.69 | 19.31,77.69 18.75,77.12 10.88,77.12 9.75,78.25 J5.2 | 19.31,77.69 20.12,78.5 20.75,78.5 JP4.2 20.88,78.5 21.88,78.5 23.25,77.12 31.25,77.12 33.5,79.38 CN1.VCC v34.5,78.5
  Bottom 0.25: JP1.3 7.25,11 8.5,12.25 10.25,12.25 17.88,19.88 17.88,52.25 19.38,53.75 JP2.2 | v34.5,78.5 45.62,78.5 50,74.12 77,74.12 J4.2
USB_GND
  pour Top: 0,85 0,0 81,0 81,85
  pour Bottom: 0,85 0,0 81,0 81,85
VBUS_VIN  (via drill 0.2)
  Top 0.25: 23.44,4.31 23.88,4.75 23.88,5.25 J1.A9 | 23.44,4.31 23.25,4.12 21.25,4.12 21,4.38 21,5.25 J1.B9 | v23.5,4.25 23.44,4.31
  Bottom 0.25: v23.5,4.25 28.12,8.88 31.12,8.88 32.25,7.75 33.12,7.75 S1.5
VIN
  Top 0.25: S1.6 35.88,7.75 67.38,7.75 78.12,18.5 78.12,61.88 62.75,77.25 62.75,79.88 61.88,80.75 61.88,81 IC1.2
VOUT  (via drill 0.2)
  Top 0.25: v76.62,22.62 76.62,52 52.25,76.38 52.25,78.88 54.12,80.75 54.12,81 IC1.5
  Bottom 0.25: v76.62,22.62 76.62,19.75 R1.1 | IC1.5 54,81 52.88,82.12 23,82.12 22,81.12 20.88,81.12 JP4.1

### Text on the board
tPlace: DIN | Output / Switch | Output | - | + | DOUT | Switch / Bridge | Power / Button | StemmaQT / T.Sensor | + | - | TOP | 5V0 | GND | Input / Switch | Vss | Input | NC | GND | Output Power / 5V0 | S13V30F5 | RGB | + | - | FAN / 5V0 | RPi.Streamerboard | Vin: 2.8-22V / ----------- / Vout: 5V / Iout: 3A | v1.2 | Hifiberry Digi2 Pro | USB-A | R2 | R3 | Power / Switch | USB-C | Info COAX Out
bPlace: Info UBS3.0 Slot | BOTTOM | USB-A | RPi / Streamer_PCB | MAE_2023_v1.2 / Build_10072023 | R5 | T.Sensor / SHT45 | R4 | C1 | R7 | RPi | HDMI | R6 | R8 | T.Sensor | R1 | Power | Raspberry Pi 4 Model B | Info SD Slot